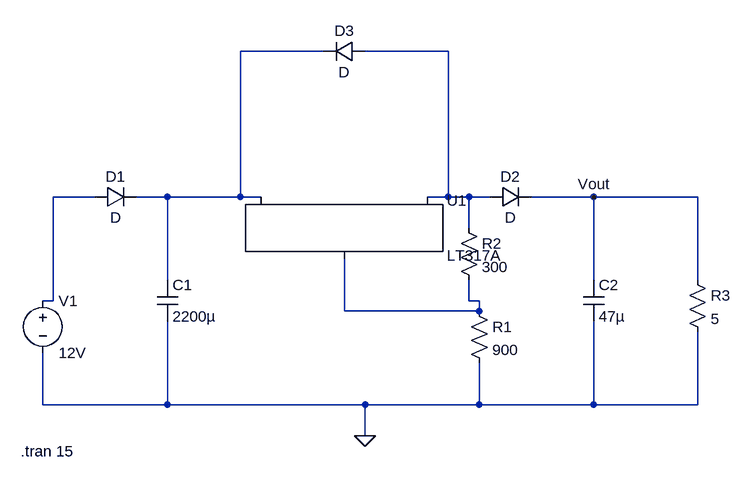
[diagram p0: schematic Voltage Regulator Simulation.asc]
Voltage Regulator Simulation.asc, the LTspice schematic file:
Version 4
SHEET 1 880 680
WIRE 176 -80 48 -80
WIRE 368 -80 240 -80
WIRE -176 144 -240 144
WIRE -64 144 -112 144
WIRE 48 144 48 -80
WIRE 48 144 -64 144
WIRE 80 144 48 144
WIRE 368 144 368 -80
WIRE 368 144 336 144
WIRE 400 144 368 144
WIRE 432 144 400 144
WIRE 592 144 496 144
WIRE 752 144 592 144
WIRE 400 192 400 144
WIRE -64 272 -64 144
WIRE 592 272 592 144
WIRE 752 272 752 144
WIRE -240 304 -240 144
WIRE -240 304 -256 304
WIRE 400 304 400 272
WIRE 416 304 400 304
WIRE 208 320 208 240
WIRE 416 320 416 304
WIRE 416 320 208 320
WIRE -256 464 -256 384
WIRE -64 464 -64 336
WIRE -64 464 -256 464
WIRE 240 464 -64 464
WIRE 416 464 416 400
WIRE 416 464 240 464
WIRE 592 464 592 336
WIRE 592 464 416 464
WIRE 752 464 752 352
WIRE 752 464 592 464
WIRE 240 512 240 464
FLAG 240 512 0
FLAG 592 144 Vout
SYMBOL PowerProducts\\LT317A 208 144 R0
SYMATTR InstName U1
SYMBOL voltage -256 288 R0
WINDOW 123 0 0 Left 0
WINDOW 39 0 0 Left 0
SYMATTR InstName V1
SYMATTR Value 12V
SYMBOL cap -80 272 R0
SYMATTR InstName C1
SYMATTR Value 2200µ
SYMBOL diode -176 160 R270
WINDOW 0 32 32 VTop 2
WINDOW 3 0 32 VBottom 2
SYMATTR InstName D1
SYMBOL diode 432 160 R270
WINDOW 0 32 32 VTop 2
WINDOW 3 0 32 VBottom 2
SYMATTR InstName D2
SYMBOL diode 240 -96 R90
WINDOW 0 0 32 VBottom 2
WINDOW 3 32 32 VTop 2
SYMATTR InstName D3
SYMBOL res 400 304 R0
SYMATTR InstName R1
SYMATTR Value 900
SYMBOL res 384 176 R0
SYMATTR InstName R2
SYMATTR Value 300
SYMBOL cap 576 272 R0
SYMATTR InstName C2
SYMATTR Value 47µ
SYMBOL res 736 256 R0
SYMATTR InstName R3
SYMATTR Value 5
TEXT -290 536 Left 2 !.tran 15

The netlist it stands for:
* Voltage Regulator Simulation.asc
XU1 N004 N002 N001 LT317A
V1 N003 0 12V
C1 N001 0 2200µ
D1 N003 N001 D
D2 N002 Vout D
D3 N002 N001 D
R1 N004 0 900
R2 N002 N004 300
C2 Vout 0 47µ
R3 Vout 0 5
.model D D
.lib standard.dio
.tran 15
.lib LTC.lib
.backanno
.end